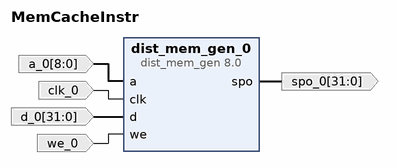
[diagram p0: block diagram of the top level]
# Vivado block design MemCacheInstr, xc7vx485tffg1157-1, Vivado 2021.2
create_bd_design MemCacheInstr

create_bd_port -dir I -from 8 -to 0 a_0
create_bd_port -dir I -from 31 -to 0 d_0
create_bd_port -dir I clk_0
create_bd_port -dir I we_0
create_bd_port -dir O -from 31 -to 0 spo_0

create_bd_cell -type ip -vlnv xilinx.com:ip:dist_mem_gen:8.0 dist_mem_gen_0
set_property -dict [list \
  CONFIG.coefficient_file ../../../../../../Coe/Cache/MemCacheInstr.coe \
  CONFIG.data_width 32 \
  CONFIG.depth 512 \
] [get_bd_cells dist_mem_gen_0]

# ---- connections ----

connect_bd_net -net a_0_1 [get_bd_ports a_0] [get_bd_pins dist_mem_gen_0/a]
connect_bd_net -net clk_0_1 [get_bd_ports clk_0] [get_bd_pins dist_mem_gen_0/clk]
connect_bd_net -net d_0_1 [get_bd_ports d_0] [get_bd_pins dist_mem_gen_0/d]
connect_bd_net [get_bd_pins dist_mem_gen_0/spo] [get_bd_ports spo_0]
connect_bd_net -net we_0_1 [get_bd_ports we_0] [get_bd_pins dist_mem_gen_0/we]

validate_bd_design
save_bd_design
